# EAGLE design untitled (EAGLE 7.3.2)
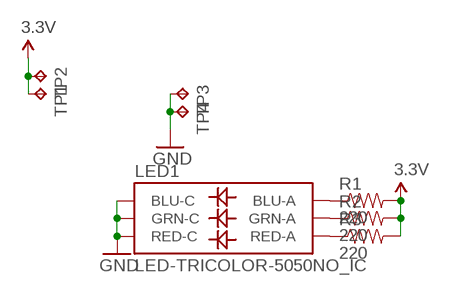
[diagram p0: schematic, sheet 1]

## Parts
LED1  LED-TRICOLOR-5050NO_IC  [LED-TRICOLOR-5050]
R1  220  220OHM-1/10W-1%(0603)  [0603-RES]
R2  220  220OHM-1/10W-1%(0603)  [0603-RES]
R3  220  220OHM-1/10W-1%(0603)  [0603-RES]
TP1  TPTP15SQ  [TP15SQ]
TP2  TPTP15SQ  [TP15SQ]
TP3  TPTP15SQ  [TP15SQ]
TP4  TPTP15SQ  [TP15SQ]

## Nets
3.3V: R1.2 R2.2 R3.2 TP1.TP TP2.TP
GND: LED1.4(BLU-C) LED1.5(RED-C) LED1.6(GRN-C) TP3.TP TP4.TP
N$3: LED1.3(BLU-A) R1.1
N$4: LED1.1(GRN-A) R2.1
N$5: LED1.2(RED-A) R3.1

## Library data of the parts
LED1 = SparkFun-LED:LED-TRICOLOR-5050
R1-R3 = SparkFun-Resistors:220OHM-1/10W-1%(0603): RES-07861; PROD_ID: RES-07861
TP1-TP4 = testpad:TP: Test pad

## Board
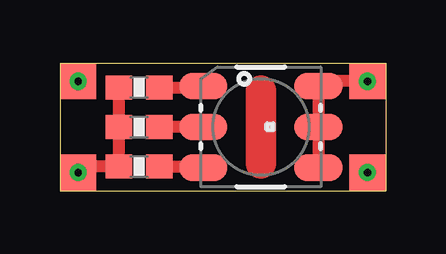
[diagram p1: board, top side]
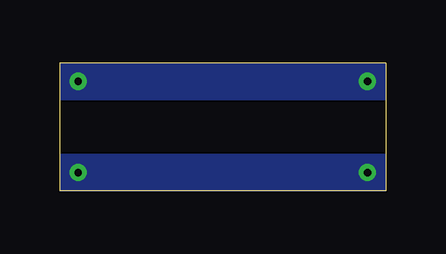
[diagram p2: board, bottom side, seen from below]

Size 13.59 x 5.33 mm. Coordinates in mm from the lower left corner, seen from the top.
Outline: 0,5.33 0,0 13.59,0 13.59,5.33 0,5.33
Copper layers (1*16): Top 0.035mm / dielectric 1.5mm / Bottom 0.035mm
Design rules "default *": minimum track width 6mil, minimum drill 12mil, track to track 6mil, track to pad 6mil, pad to pad 6mil, via to via 6mil, smd to smd 6mil, copper to edge 0mil, drill to drill 8mil, minimum pad ring 10mil, minimum via ring 8mil, stop-mask expansion 4mil, vias tented up to drill 12mil, thermal gap 10mil

### Footprints (pad centres in the part's own frame; a part is rotated, then mirrored left to right if it is on the bottom)
LED-TRICOLOR-5050 = smd 2 x 1.1: 1 -2.4,1.7; 2 -2.4,0; 3 -2.4,-1.7; 4 2.4,-1.7; 5 2.4,0; 6 2.4,1.7
0603-RES = smd 1.1 x 1: 1 -0.85,0; 2 0.85,0
TP15SQ = smd 1.5 x 1.5: TP 0,0

### Placement (x,y rotation side)
LED1  8.38,2.67 0 top
R1  3.3,1.02 180 top
R2  3.3,4.32 180 top
R3  3.3,2.67 180 top
TP1  0.76,0.76 0 top
TP2  12.83,0.76 0 top
TP3  0.76,4.57 0 top
TP4  12.83,4.57 0 top

### Tracks (layer width: path | path; a pad name or v marks a point on that pad's centre or on a via)
3.3V  (via drill 0.3)
  Top 0.508: R2.2 R3.2 R1.2 0.76,1.02 TP1.TP
  other vias: 12.83,0.76 0.76,0.76
  pour Bottom (no thermals): 0,1.52 13.59,1.52 13.59,0 0,0
GND  (via drill 0.3)
  Top 0.508: LED1.4 LED1.5 LED1.6 10.78,4.57 TP4.TP
  other vias: 12.83,4.57 0.76,4.57
  pour Bottom (no thermals): 0,5.33 13.59,5.33 13.59,3.81 0,3.81
N$1
  Top 1.27: 8.38,4.19 8.38,1.14
N$3
  Top 0.508: R1.1 5.98,1.02 LED1.3
N$4
  Top 0.508: R2.1 5.98,4.32 LED1.1
N$5
  Top 0.508: LED1.2 R3.1